# Altium schematic sheet Driver.SchDoc
size A4; SheetNumber: 5; SheetTotal: 8
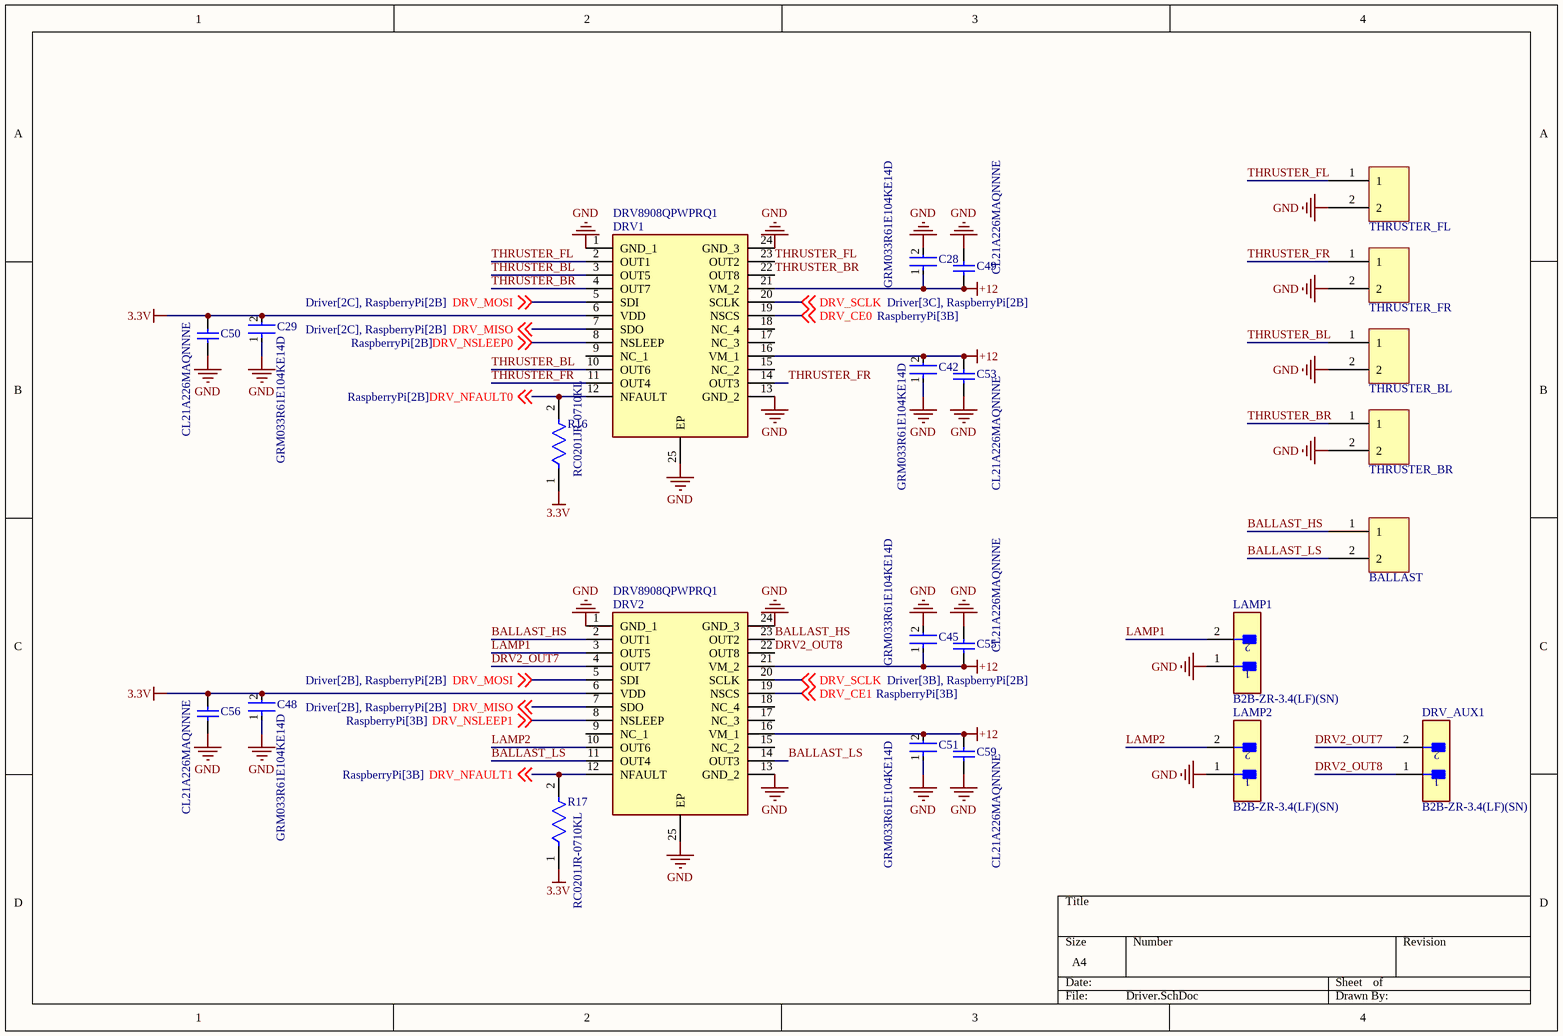
[diagram p0: Driver.SchDoc]

## Parts
BALLAST  WJ500V-5.08-2P  [WJ500V-5.08-2P]  (value not drawn)
C28  GRM033R61E104KE14D  [FP-GRM033-0_03-IPC_B]
C29  GRM033R61E104KE14D  [FP-GRM033-0_03-IPC_B]
C42  GRM033R61E104KE14D  [FP-GRM033-0_03-IPC_B]
C45  GRM033R61E104KE14D  [FP-GRM033-0_03-IPC_B]
C48  GRM033R61E104KE14D  [FP-GRM033-0_03-IPC_B]
C49  CL21A226MAQNNNE  [CAPC2013X140X45LL15T25]
C50  CL21A226MAQNNNE  [CAPC2013X140X45LL15T25]
C51  GRM033R61E104KE14D  [FP-GRM033-0_03-IPC_B]
C53  CL21A226MAQNNNE  [CAPC2013X140X45LL15T25]
C55  CL21A226MAQNNNE  [CAPC2013X140X45LL15T25]
C56  CL21A226MAQNNNE  [CAPC2013X140X45LL15T25]
C59  CL21A226MAQNNNE  [CAPC2013X140X45LL15T25]
DRV1  DRV8908QPWPRQ1  [SOP65P640X120-25N]
DRV2  DRV8908QPWPRQ1  [SOP65P640X120-25N]
DRV_AUX1  B2B-ZR-3.4(LF)(SN)  [FP-B2B-ZR-3_4_LF_SN-MFG]
LAMP1  B2B-ZR-3.4(LF)(SN)  [FP-B2B-ZR-3_4_LF_SN-MFG]
LAMP2  B2B-ZR-3.4(LF)(SN)  [FP-B2B-ZR-3_4_LF_SN-MFG]
R16  RC0201JR-0710KL  [FP-RC0201-0_26-IPC_C]
R17  RC0201JR-0710KL  [FP-RC0201-0_26-IPC_C]
THRUSTER_BL  WJ500V-5.08-2P  [WJ500V-5.08-2P]  (value not drawn)
THRUSTER_BR  WJ500V-5.08-2P  [WJ500V-5.08-2P]  (value not drawn)
THRUSTER_FL  WJ500V-5.08-2P  [WJ500V-5.08-2P]  (value not drawn)
THRUSTER_FR  WJ500V-5.08-2P  [WJ500V-5.08-2P]  (value not drawn)

## Nets
3.3V: C29.2 C48.2 C50.2 C56.2 DRV1.6(VDD) DRV2.6(VDD) R16.1 R17.1
+12: C28.1 C42.2 C45.1 C49.2 C51.2 C53.2 C55.2 C59.2 DRV1.16(VM_1) DRV1.21(VM_2) DRV2.16(VM_1) DRV2.21(VM_2)
GND: C28.2 C29.1 C42.1 C45.2 C48.1 C49.1 C50.1 C51.1 C53.1 C55.1 C56.1 C59.1 DRV1.1(GND_1) DRV1.13(GND_2) DRV1.24(GND_3) DRV1.25(EP) DRV2.1(GND_1) DRV2.13(GND_2) DRV2.24(GND_3) DRV2.25(EP) LAMP1.1 LAMP2.1 THRUSTER_BL.2 THRUSTER_BR.2 THRUSTER_FL.2 THRUSTER_FR.2
BALLAST_HS: BALLAST.1 DRV2.2(OUT1) DRV2.23(OUT2)
BALLAST_LS: BALLAST.2 DRV2.11(OUT4) DRV2.14(OUT3)
DRV2_OUT7: DRV2.4(OUT7) DRV_AUX1.2
DRV2_OUT8: DRV2.22(OUT8) DRV_AUX1.1
DRV_CE0: DRV1.19(NSCS) ; off-sheet DRV_CE0
DRV_CE1: DRV2.19(NSCS) ; off-sheet DRV_CE1
DRV_MISO: DRV1.7(SDO) DRV2.7(SDO) ; off-sheet DRV_MISO
DRV_MOSI: DRV1.5(SDI) DRV2.5(SDI) ; off-sheet DRV_MOSI
DRV_NFAULT0: DRV1.12(NFAULT) R16.2 ; off-sheet DRV_NFAULT0
DRV_NFAULT1: DRV2.12(NFAULT) R17.2 ; off-sheet DRV_NFAULT1
DRV_NSLEEP0: DRV1.8(NSLEEP) ; off-sheet DRV_NSLEEP0
DRV_NSLEEP1: DRV2.8(NSLEEP) ; off-sheet DRV_NSLEEP1
DRV_SCLK: DRV1.20(SCLK) DRV2.20(SCLK) ; off-sheet DRV_SCLK
LAMP1: DRV2.3(OUT5) LAMP1.2
LAMP2: DRV2.10(OUT6) LAMP2.2
THRUSTER_BL: DRV1.3(OUT5) DRV1.10(OUT6) THRUSTER_BL.1
THRUSTER_BR: DRV1.4(OUT7) DRV1.22(OUT8) THRUSTER_BR.1
THRUSTER_FL: DRV1.2(OUT1) DRV1.23(OUT2) THRUSTER_FL.1
THRUSTER_FR: DRV1.11(OUT4) DRV1.14(OUT3) THRUSTER_FR.1

Not connected (* = marked no-connect by the designer): DRV1 9(NC_1) 15(NC_2) 17(NC_3) 18(NC_4); DRV2 9(NC_1) 15(NC_2) 17(NC_3) 18(NC_4)

## Library data of the parts
C28 C29 C42 C45 C48 C51 = CMP-06035-036234-1: Chip Multilayer Ceramic Capacitors for General Purpose, 0201, 0.10uF, X5R, 15%, 10%, 25V; Capacitance: 100nF; Case/Package: 0201; Mount: Surface Mount; Resistor Type: Ceramic; Package Quantity: 15000; Height: 0.3mm; Length: 0.024inch; Weight: 1.2E-05oz; Dielectric: X5R; Thickness: 0.013inch; Max Operating Temperature: 85°C; Case Code (Imperial): 0201; Voltage Rating: 25V; Case Code (Metric): 0603; Voltage Rating (DC): 25V; Width: 0.012inch; Termination: SMD/SMT; Tolerance: 10%; Min Operating Temperature: -55°C; Packaging: Tape and Reel; Lead Free: Lead Free
C49 C50 C53 C55 C56 C59 = CMP-2000-06104-1: Multi-layer Ceramic Capacitor, 22 uF, -55 to 85 degC, 2-Pin SMD (0805), RoHS, Tape and Reel; Manufacturer: Samsung Electro-Mechanics; Voltage - Rated: 25V; Other Names: 1276-2908-2; Capacitance: 22µF; Featured Product: Multi-LayerCeramicCapacitors; Product Training Modules: HighCapMLCCFamily; Temperature Coefficient: X5R; Tolerance: ±20%; Online Catalog: CLSeries,HighCapacitance; Applications: GeneralPurpose; RoHS Information: MLCCRoHS2Compliance; Height - Seated (Max): -; Lead Style: -; Lead Spacing: -; Datasheet URL: http://datasheet.octopart.com/CL21A226MAQNNNE-Samsung-datasheet-48647558.pdf; Size / Dimension: 0.079"Lx0.049"W(2.00mmx1.25mm); Thickness (Max): 0.055"(1.40mm); Family: CeramicCapacitors; Package Description: 2-Pin Surface Mount Device, Body 2.0 x 1.25 mm; Datasheet Version: 07/2015; Packaging: Tape&Reel(TR); Manufacturer URL: http://www.samsungsem.com/global/index.jsp; Ratings: -; Package / Case: 0805(2012Metric); Standard Package: 2,000; Mounting Type: SurfaceMount,MLCC; Mounting Technology: SurfaceMount; Category: Capacitors; Package Reference: 0805; Series: CL; Features: -; Operating Temperature: -55°C~85°C
DRV1 DRV2 = DRV8908QPWPRQ1: Integrated Circuit; Manufacturer_Name: Texas Instruments; Datasheet Link: https://www.ti.com/lit/gpn/DRV8908-Q1; Height: 1.2mm; Manufacturer_Part_Number: DRV8908QPWPRQ1; Mouser Part Number: 595-DRV8908QPWPRQ1; Mouser Price/Stock: https://www.mouser.co.uk/ProductDetail/Texas-Instruments/DRV8908QPWPRQ1?qs=GBLSl2Akirv2iYVv21RwNA%3D%3D; Arrow Part Number: DRV8908QPWPRQ1; Arrow Price/Stock: https://www.arrow.com/en/products/drv8908qpwprq1/texas-instruments
DRV_AUX1 LAMP1 LAMP2 = CMP-17439-000601-1: CONN HEADER VERT 2POS 1.5MM; Mated Stacking Heights: 5.6mm; Voltage Rating: 50V; Number of Positions: 2; Termination: Press-Fit; Insulation Color: Natural; Pitch: 1.5mm; Number of Rows: 1; Fastening Type: Detent; Insulation Material: Nylon; Contact Shape: Circular; Lead Free: Lead Free; Series: ZH; Connector Type: Header; Contact Type: Male Pin; Packaging: Bulk; Contact Finish - Mating: TIN; Mount: Through Hole; Contact Material: Brass; Flammability Rating: UL94 V-0
R16 R17 = CMP-03412-037826-1: RES SMD 10K OHM 5% 1/20W 0201; Voltage Rating: 25V; Max Power Dissipation: 50mW; Temperature Coefficient: 200ppm/°C; Resistance: 10kR; Min Operating Temperature: -55°C; Packaging: Tape and Reel; Tolerance: 5%; Length: 0.6mm; Contact Plating: Tin; Features: Moisture Resistant; Radiation Hardening: No; Military Standard: Not; Voltage Rating (DC): 25V; Termination: SMD/SMT; Size Code: 0201; Resistance Tolerance: 5%; Case Code (Imperial): 0201; Resistor Type: Thick Film; Depth: 0.3mm; Series: RC; Lead Free: Lead Free; Power Rating: 50mW; Number of Terminations: 2; Case Code (Metric): 0603; RoHS Compliant: Yes; Max Operating Temperature: 125°C; Construction: Rectangular; Case/Package: 0201